# EAGLE schematic vr98 (EAGLE 9.6.2)

## Sheet 1 of 2
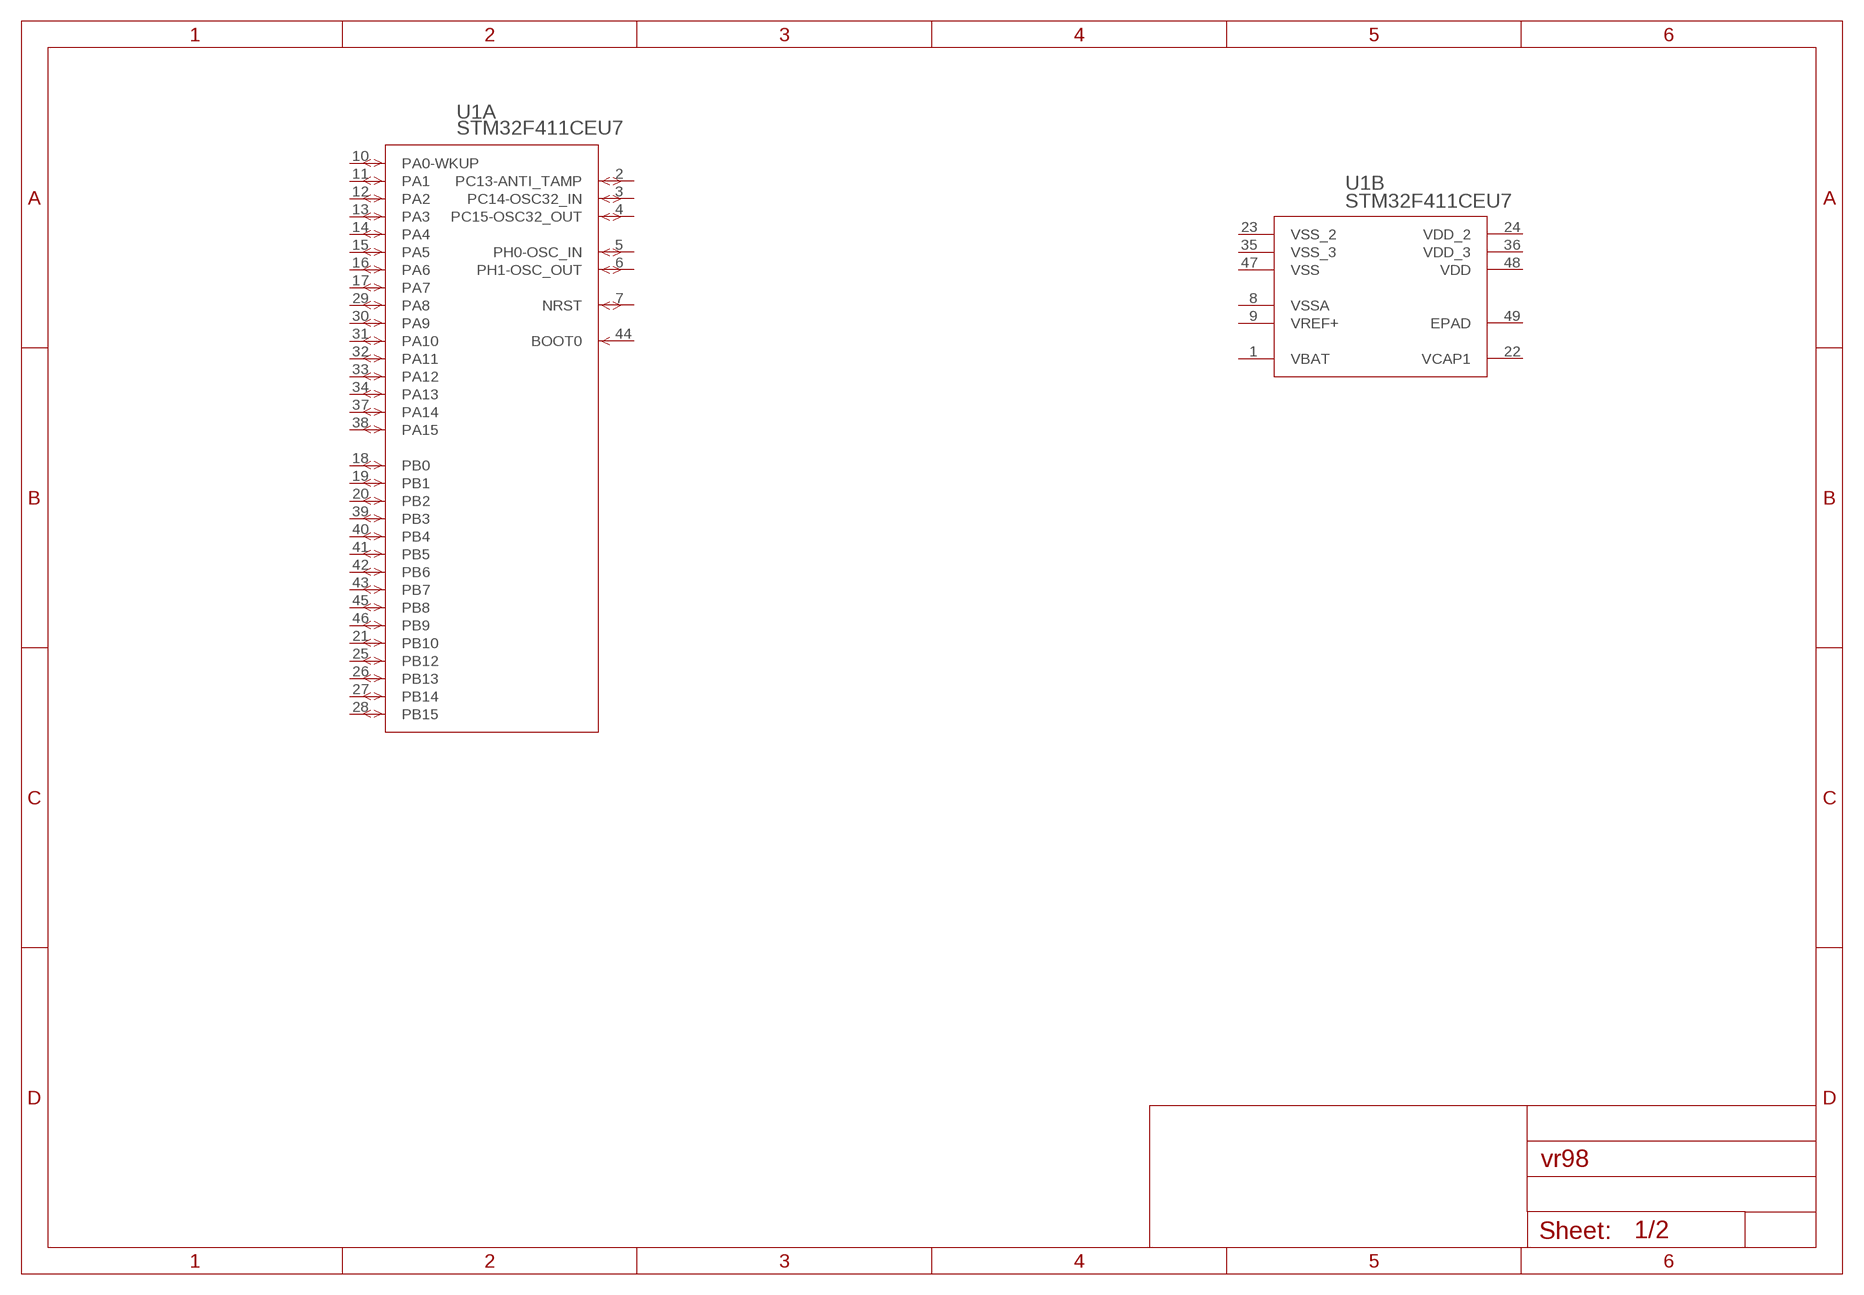
[diagram p0: schematic, sheet 1]

### Parts
U1  STM32F411CEU7  [UFQFPN-48_7X7X0P55MM]
Unconnected: U1.2(A:PC13-ANTI_TAMP) U1.3(A:PC14-OSC32_IN) U1.4(A:PC15-OSC32_OUT) U1.5(A:PH0-OSC_IN) U1.6(A:PH1-OSC_OUT) U1.7(A:NRST) U1.10(A:PA0-WKUP) U1.11(A:PA1) U1.12(A:PA2) U1.13(A:PA3) U1.14(A:PA4) U1.15(A:PA5) U1.16(A:PA6) U1.17(A:PA7) U1.18(A:PB0) U1.19(A:PB1) U1.20(A:PB2) U1.21(A:PB10) U1.25(A:PB12) U1.26(A:PB13) U1.27(A:PB14) U1.28(A:PB15) U1.29(A:PA8) U1.30(A:PA9) U1.31(A:PA10) U1.32(A:PA11) U1.33(A:PA12) U1.34(A:PA13) U1.37(A:PA14) U1.38(A:PA15) U1.39(A:PB3) U1.40(A:PB4) U1.41(A:PB5) U1.42(A:PB6) U1.43(A:PB7) U1.44(A:BOOT0) U1.45(A:PB8) U1.46(A:PB9) U1.49(B:EPAD)

## Sheet 2 of 2
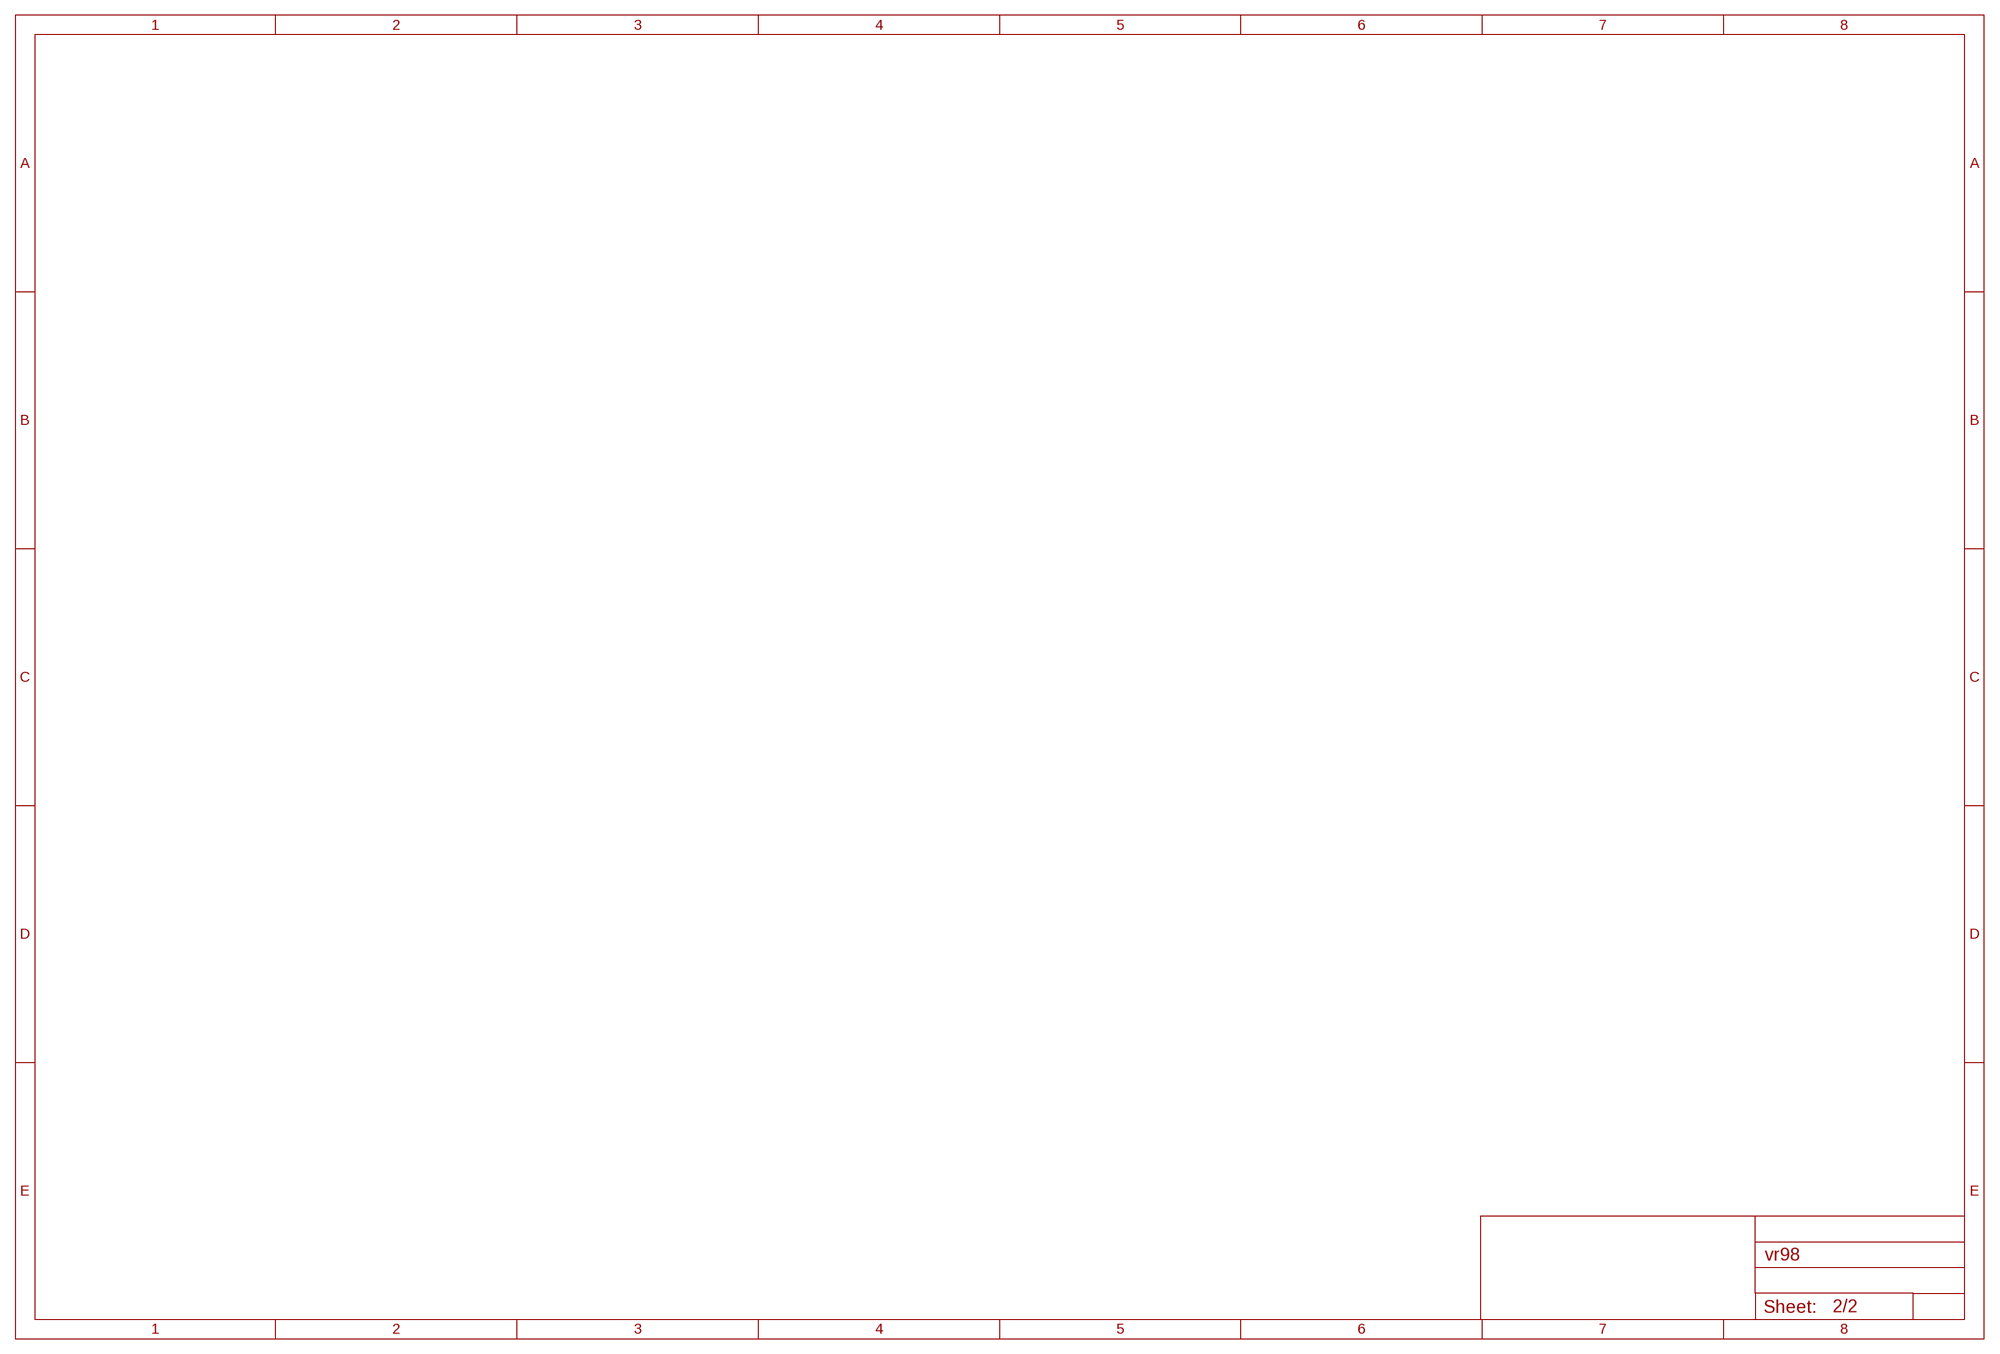
[diagram p1: schematic, sheet 2]

## Power pins joined to a net without a drawn wire
VBAT: U1.1(B:VBAT)
VCAP1: U1.22(B:VCAP1)
VDD: U1.48(B:VDD)
VDD_2: U1.24(B:VDD_2)
VDD_3: U1.36(B:VDD_3)
VREF+: U1.9(B:VREF+)
VSS: U1.47(B:VSS)
VSS_2: U1.23(B:VSS_2)
VSS_3: U1.35(B:VSS_3)
VSSA: U1.8(B:VSSA)

## Library data of the parts
U1 = st:STM32F411CEU7; COPYRIGHT: Copyright (C) 2023 Ultra Librarian. All rights reserved.; MANUFACTURER_PART_NUMBER: STM32F411CEU7; MFR_NAME: STMicroelectronics